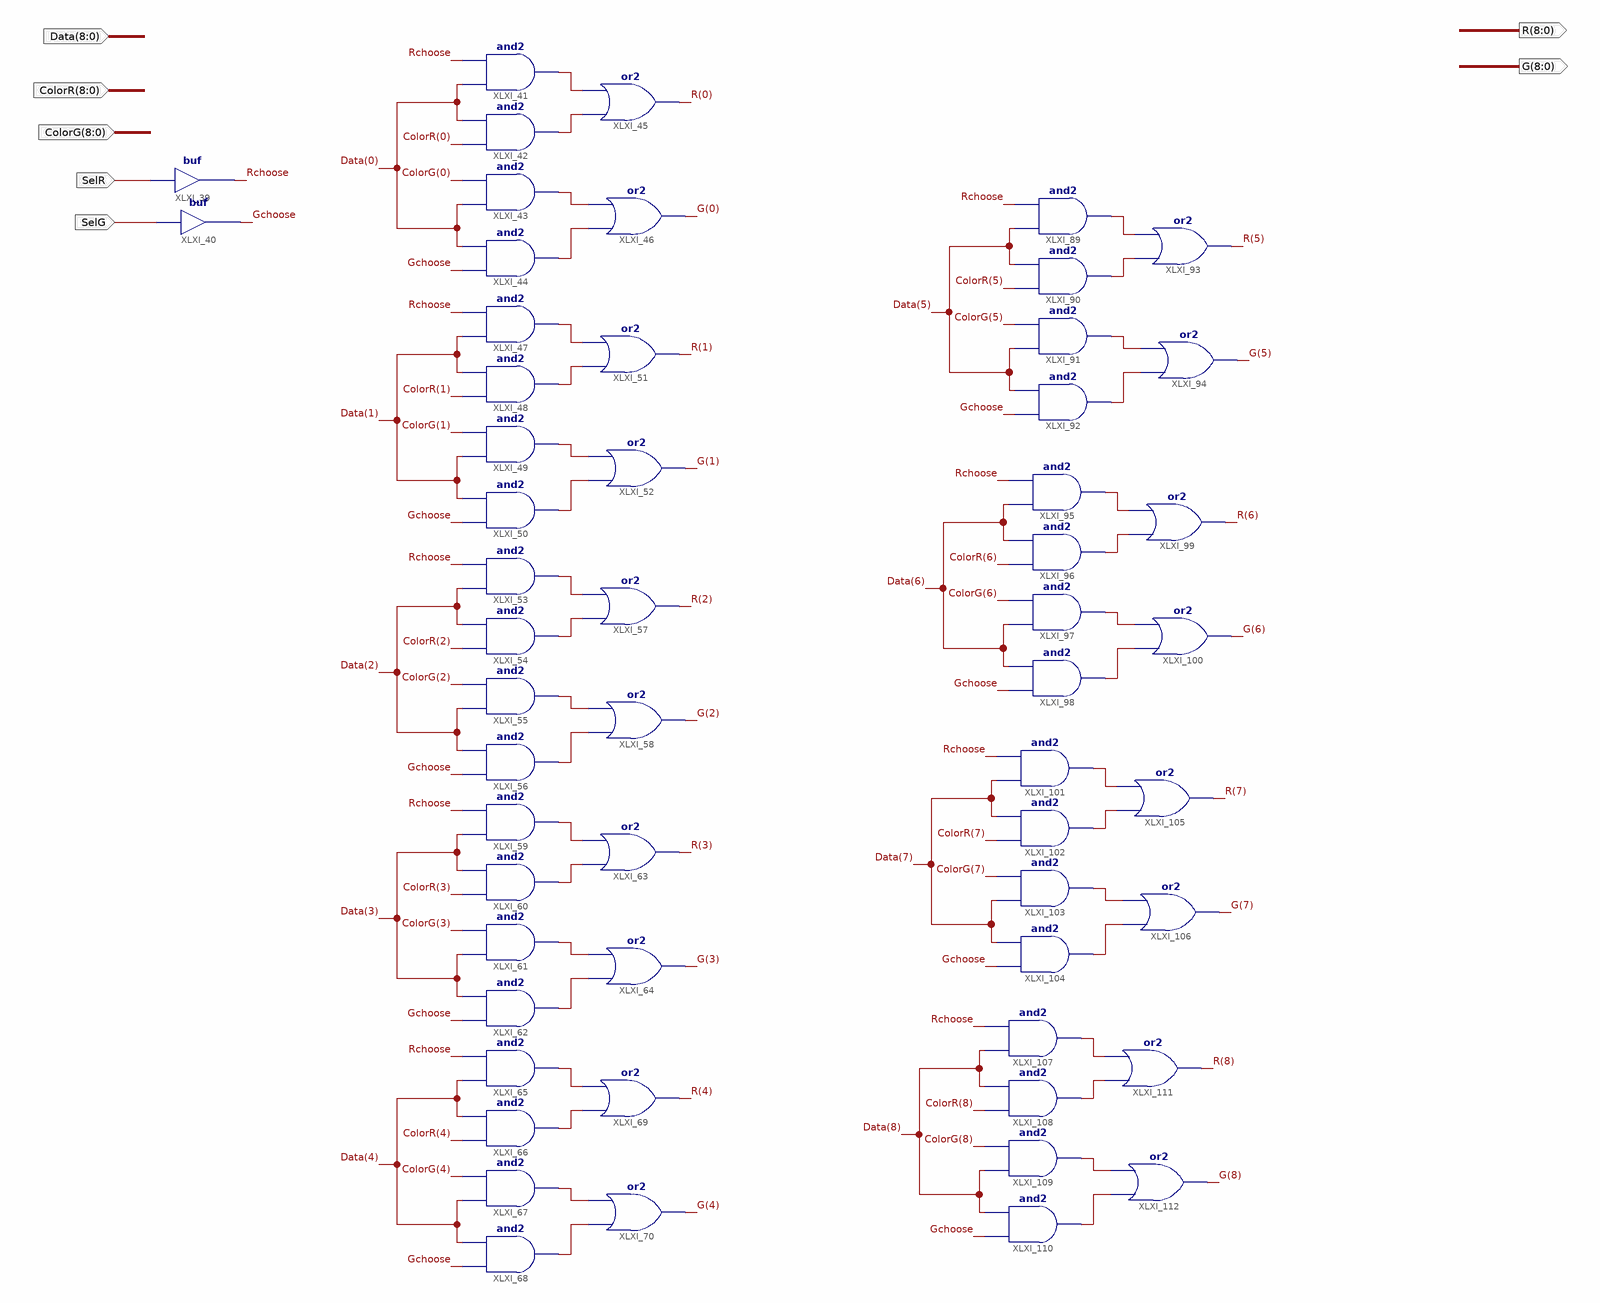
[diagram p0: schematic sheet 1]
// Xilinx ISE schematic addDataWithColor.sch (spartan6) as structural Verilog: 56 symbols, 7 ports
module addDataWithColor (
  input  [8:0] Data,
  input  [8:0] ColorR,
  input  [8:0] ColorG,
  input  SelR,
  input  SelG,
  output [8:0] R,
  output [8:0] G
);

  wire Gchoose, Rchoose, XLXN_75, XLXN_76, XLXN_77, XLXN_78, XLXN_89, XLXN_90, XLXN_91, XLXN_92, XLXN_103,
       XLXN_104, XLXN_105, XLXN_106, XLXN_117, XLXN_118, XLXN_119, XLXN_120, XLXN_131, XLXN_132, XLXN_133,
       XLXN_134, XLXN_187, XLXN_188, XLXN_189, XLXN_190, XLXN_201, XLXN_202, XLXN_203, XLXN_204, XLXN_215,
       XLXN_216, XLXN_217, XLXN_218, XLXN_229, XLXN_230, XLXN_231, XLXN_232;

  buf XLXI_39 (Rchoose, SelR);
  buf XLXI_40 (Gchoose, SelG);
  and XLXI_41 (XLXN_75, Data[0], Rchoose);
  and XLXI_42 (XLXN_76, ColorR[0], Data[0]);
  and XLXI_43 (XLXN_77, Data[0], ColorG[0]);
  and XLXI_44 (XLXN_78, Gchoose, Data[0]);
  or XLXI_45 (R[0], XLXN_76, XLXN_75);
  or XLXI_46 (G[0], XLXN_78, XLXN_77);
  and XLXI_47 (XLXN_89, Data[1], Rchoose);
  and XLXI_48 (XLXN_90, ColorR[1], Data[1]);
  and XLXI_49 (XLXN_91, Data[1], ColorG[1]);
  and XLXI_50 (XLXN_92, Gchoose, Data[1]);
  or XLXI_51 (R[1], XLXN_90, XLXN_89);
  or XLXI_52 (G[1], XLXN_92, XLXN_91);
  and XLXI_53 (XLXN_103, Data[2], Rchoose);
  and XLXI_54 (XLXN_104, ColorR[2], Data[2]);
  and XLXI_55 (XLXN_105, Data[2], ColorG[2]);
  and XLXI_56 (XLXN_106, Gchoose, Data[2]);
  or XLXI_57 (R[2], XLXN_104, XLXN_103);
  or XLXI_58 (G[2], XLXN_106, XLXN_105);
  and XLXI_59 (XLXN_117, Data[3], Rchoose);
  and XLXI_60 (XLXN_118, ColorR[3], Data[3]);
  and XLXI_61 (XLXN_119, Data[3], ColorG[3]);
  and XLXI_62 (XLXN_120, Gchoose, Data[3]);
  or XLXI_63 (R[3], XLXN_118, XLXN_117);
  or XLXI_64 (G[3], XLXN_120, XLXN_119);
  and XLXI_65 (XLXN_131, Data[4], Rchoose);
  and XLXI_66 (XLXN_132, ColorR[4], Data[4]);
  and XLXI_67 (XLXN_133, Data[4], ColorG[4]);
  and XLXI_68 (XLXN_134, Gchoose, Data[4]);
  or XLXI_69 (R[4], XLXN_132, XLXN_131);
  or XLXI_70 (G[4], XLXN_134, XLXN_133);
  and XLXI_89 (XLXN_187, Data[5], Rchoose);
  and XLXI_90 (XLXN_188, ColorR[5], Data[5]);
  and XLXI_91 (XLXN_189, Data[5], ColorG[5]);
  and XLXI_92 (XLXN_190, Gchoose, Data[5]);
  or XLXI_93 (R[5], XLXN_188, XLXN_187);
  or XLXI_94 (G[5], XLXN_190, XLXN_189);
  and XLXI_95 (XLXN_201, Data[6], Rchoose);
  and XLXI_96 (XLXN_202, ColorR[6], Data[6]);
  and XLXI_97 (XLXN_203, Data[6], ColorG[6]);
  and XLXI_98 (XLXN_204, Gchoose, Data[6]);
  or XLXI_99 (R[6], XLXN_202, XLXN_201);
  or XLXI_100 (G[6], XLXN_204, XLXN_203);
  and XLXI_101 (XLXN_215, Data[7], Rchoose);
  and XLXI_102 (XLXN_216, ColorR[7], Data[7]);
  and XLXI_103 (XLXN_217, Data[7], ColorG[7]);
  and XLXI_104 (XLXN_218, Gchoose, Data[7]);
  or XLXI_105 (R[7], XLXN_216, XLXN_215);
  or XLXI_106 (G[7], XLXN_218, XLXN_217);
  and XLXI_107 (XLXN_229, Data[8], Rchoose);
  and XLXI_108 (XLXN_230, ColorR[8], Data[8]);
  and XLXI_109 (XLXN_231, Data[8], ColorG[8]);
  and XLXI_110 (XLXN_232, Gchoose, Data[8]);
  or XLXI_111 (R[8], XLXN_230, XLXN_229);
  or XLXI_112 (G[8], XLXN_232, XLXN_231);
endmodule
